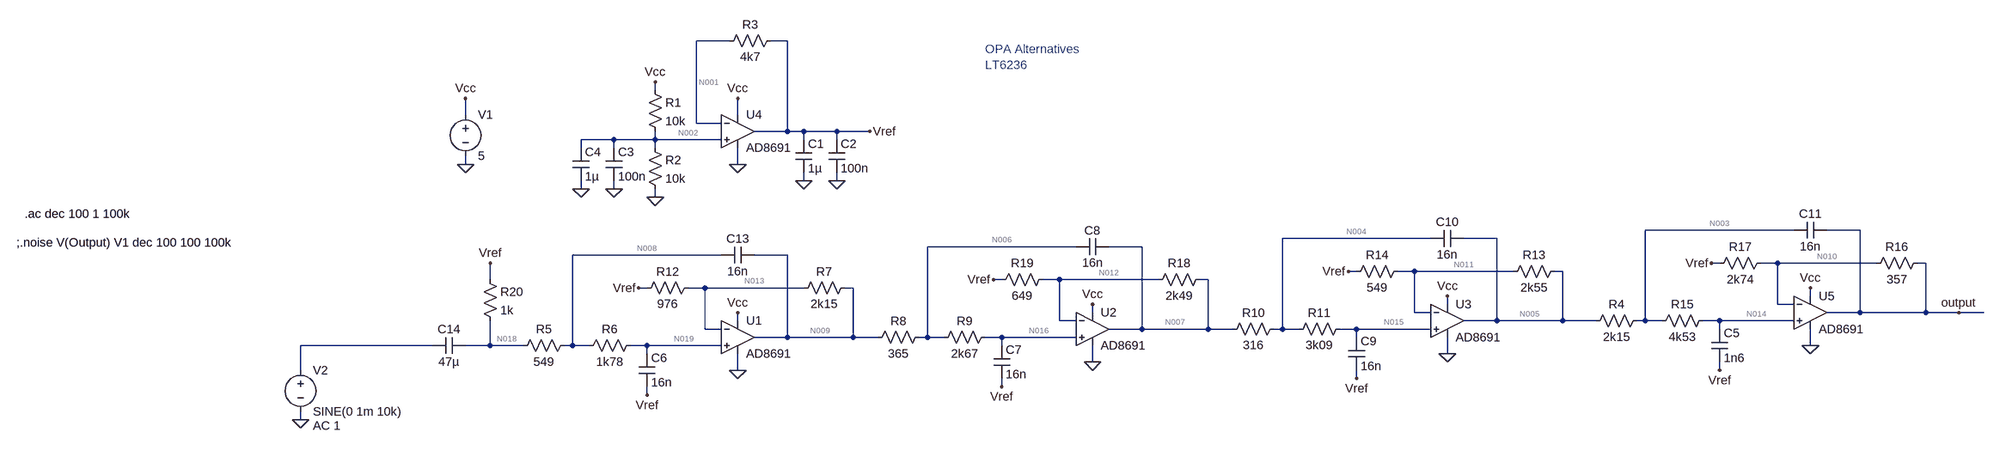
[diagram p0: schematic Input_Stage_10kHz_v2.asc]
Input_Stage_10kHz_v2.asc, the LTspice schematic file:
Version 4
SHEET 1 3012 680
WIRE 272 -400 208 -400
WIRE 384 -400 352 -400
WIRE 128 -304 128 -320
WIRE -240 -256 -240 -288
WIRE 288 -256 288 -288
WIRE 208 -240 208 -400
WIRE 256 -240 208 -240
WIRE 384 -224 384 -400
WIRE 384 -224 320 -224
WIRE 416 -224 384 -224
WIRE 480 -224 416 -224
WIRE 544 -224 480 -224
WIRE 48 -208 -16 -208
WIRE 128 -208 128 -224
WIRE 128 -208 48 -208
WIRE 256 -208 128 -208
WIRE 416 -208 416 -224
WIRE 480 -208 480 -224
WIRE -16 -192 -16 -208
WIRE 48 -192 48 -208
WIRE 128 -192 128 -208
WIRE -240 -160 -240 -176
WIRE 288 -160 288 -192
WIRE 416 -128 416 -144
WIRE 480 -128 480 -144
WIRE -16 -112 -16 -128
WIRE 48 -112 48 -128
WIRE 128 -96 128 -112
WIRE 2336 -32 2048 -32
WIRE 2464 -32 2400 -32
WIRE 1632 -16 1344 -16
WIRE 1760 -16 1696 -16
WIRE 944 0 656 0
WIRE 1072 0 1008 0
WIRE 256 16 -32 16
WIRE 384 16 320 16
WIRE 2192 32 2176 32
WIRE 2304 32 2272 32
WIRE 2496 32 2304 32
WIRE 2592 32 2576 32
WIRE 1488 48 1472 48
WIRE 1600 48 1568 48
WIRE 1792 48 1600 48
WIRE 1888 48 1872 48
WIRE -192 64 -192 32
WIRE 800 64 784 64
WIRE 912 64 880 64
WIRE 1104 64 912 64
WIRE 1200 64 1184 64
WIRE 112 80 96 80
WIRE 224 80 192 80
WIRE 416 80 224 80
WIRE 512 80 496 80
WIRE 2368 96 2368 80
WIRE 1664 112 1664 96
WIRE 2304 112 2304 32
WIRE 2336 112 2304 112
WIRE 976 128 976 112
WIRE 1600 128 1600 48
WIRE 1632 128 1600 128
WIRE 2464 128 2464 -32
WIRE 2464 128 2400 128
WIRE 2592 128 2592 32
WIRE 2592 128 2464 128
WIRE 2656 128 2592 128
WIRE 2704 128 2656 128
WIRE 288 144 288 128
WIRE 912 144 912 64
WIRE 944 144 912 144
WIRE 1760 144 1760 -16
WIRE 1760 144 1696 144
WIRE 1888 144 1888 48
WIRE 1888 144 1760 144
WIRE 1952 144 1888 144
WIRE 2048 144 2048 -32
WIRE 2048 144 2032 144
WIRE 2080 144 2048 144
WIRE 2192 144 2160 144
WIRE 2336 144 2192 144
WIRE 224 160 224 80
WIRE 256 160 224 160
WIRE 1072 160 1072 0
WIRE 1072 160 1008 160
WIRE 1200 160 1200 64
WIRE 1200 160 1072 160
WIRE 1248 160 1200 160
WIRE 1344 160 1344 -16
WIRE 1344 160 1328 160
WIRE 1376 160 1344 160
WIRE 1488 160 1456 160
WIRE 1632 160 1488 160
WIRE 2192 160 2192 144
WIRE 384 176 384 16
WIRE 384 176 320 176
WIRE 512 176 512 80
WIRE 512 176 384 176
WIRE 560 176 512 176
WIRE 656 176 656 0
WIRE 656 176 640 176
WIRE 688 176 656 176
WIRE 800 176 768 176
WIRE 944 176 800 176
WIRE 1488 176 1488 160
WIRE -304 192 -560 192
WIRE -192 192 -192 144
WIRE -192 192 -240 192
WIRE -128 192 -192 192
WIRE -32 192 -32 16
WIRE -32 192 -48 192
WIRE 0 192 -32 192
WIRE 112 192 80 192
WIRE 256 192 112 192
WIRE 800 192 800 176
WIRE 2368 192 2368 160
WIRE 112 208 112 192
WIRE 1664 208 1664 176
WIRE 976 224 976 192
WIRE -560 240 -560 192
WIRE 288 240 288 208
WIRE 2192 240 2192 224
WIRE 1488 256 1488 240
WIRE 800 272 800 256
WIRE 112 288 112 272
WIRE -560 336 -560 320
FLAG -240 -160 0
FLAG -560 336 0
FLAG -240 -288 Vcc
FLAG 288 -160 0
FLAG 288 -288 Vcc
FLAG 128 -320 Vcc
FLAG 128 -96 0
FLAG 416 -128 0
FLAG 480 -128 0
FLAG 544 -224 Vref
FLAG -16 -112 0
FLAG 48 -112 0
FLAG 800 272 Vref
FLAG 976 224 0
FLAG 976 112 Vcc
FLAG 784 64 Vref
FLAG 112 288 Vref
FLAG 288 128 Vcc
FLAG 96 80 Vref
FLAG 2656 128 output
FLAG 1488 256 Vref
FLAG 1664 208 0
FLAG 1664 96 Vcc
FLAG 1472 48 Vref
FLAG 2192 240 Vref
FLAG 2368 192 0
FLAG 2368 80 Vcc
FLAG 2176 32 Vref
FLAG 288 240 0
FLAG -192 32 Vref
SYMBOL voltage -240 -272 R0
WINDOW 123 0 0 Left 0
WINDOW 39 0 0 Left 0
SYMATTR InstName V1
SYMATTR Value 5
SYMBOL voltage -560 224 R0
WINDOW 123 24 124 Left 2
WINDOW 39 0 0 Left 0
SYMATTR Value2 AC 1
SYMATTR InstName V2
SYMATTR Value SINE(0 1m 10k)
SYMBOL res 112 -320 R0
SYMATTR InstName R1
SYMATTR Value 10k
SYMBOL res 112 -208 R0
SYMATTR InstName R2
SYMATTR Value 10k
SYMBOL cap 400 -208 R0
SYMATTR InstName C1
SYMATTR Value 1µ
SYMBOL cap 464 -208 R0
SYMATTR InstName C2
SYMATTR Value 100n
SYMBOL cap 32 -192 R0
SYMATTR InstName C3
SYMATTR Value 100n
SYMBOL cap -32 -192 R0
SYMATTR InstName C4
SYMATTR Value 1µ
SYMBOL res 368 -416 R90
WINDOW 0 0 56 VBottom 2
WINDOW 3 32 56 VTop 2
SYMATTR InstName R3
SYMATTR Value 4k7
SYMBOL res 656 160 R90
WINDOW 0 0 56 VBottom 2
WINDOW 3 32 56 VTop 2
SYMATTR InstName R8
SYMATTR Value 365
SYMBOL res 784 160 R90
WINDOW 0 0 56 VBottom 2
WINDOW 3 32 56 VTop 2
SYMATTR InstName R9
SYMATTR Value 2k67
SYMBOL cap 784 192 R0
SYMATTR InstName C7
SYMATTR Value 16n
SYMBOL cap 1008 -16 R90
WINDOW 0 0 32 VBottom 2
WINDOW 3 32 32 VTop 2
SYMATTR InstName C8
SYMATTR Value 16n
SYMBOL res 1200 48 R90
WINDOW 0 0 56 VBottom 2
WINDOW 3 32 56 VTop 2
SYMATTR InstName R18
SYMATTR Value 2k49
SYMBOL res 896 48 R90
WINDOW 0 0 56 VBottom 2
WINDOW 3 32 56 VTop 2
SYMATTR InstName R19
SYMATTR Value 649
SYMBOL res -32 176 R90
WINDOW 0 0 56 VBottom 2
WINDOW 3 32 56 VTop 2
SYMATTR InstName R5
SYMATTR Value 549
SYMBOL res 96 176 R90
WINDOW 0 0 56 VBottom 2
WINDOW 3 32 56 VTop 2
SYMATTR InstName R6
SYMATTR Value 1k78
SYMBOL cap 96 208 R0
SYMATTR InstName C6
SYMATTR Value 16n
SYMBOL cap 320 0 R90
WINDOW 0 0 32 VBottom 2
WINDOW 3 32 32 VTop 2
SYMATTR InstName C13
SYMATTR Value 16n
SYMBOL res 512 64 R90
WINDOW 0 0 56 VBottom 2
WINDOW 3 32 56 VTop 2
SYMATTR InstName R7
SYMATTR Value 2k15
SYMBOL res 208 64 R90
WINDOW 0 0 56 VBottom 2
WINDOW 3 32 56 VTop 2
SYMATTR InstName R12
SYMATTR Value 976
SYMBOL res 1344 144 R90
WINDOW 0 0 56 VBottom 2
WINDOW 3 32 56 VTop 2
SYMATTR InstName R10
SYMATTR Value 316
SYMBOL res 1472 144 R90
WINDOW 0 0 56 VBottom 2
WINDOW 3 32 56 VTop 2
SYMATTR InstName R11
SYMATTR Value 3k09
SYMBOL cap 1472 176 R0
SYMATTR InstName C9
SYMATTR Value 16n
SYMBOL cap 1696 -32 R90
WINDOW 0 0 32 VBottom 2
WINDOW 3 32 32 VTop 2
SYMATTR InstName C10
SYMATTR Value 16n
SYMBOL res 1888 32 R90
WINDOW 0 0 56 VBottom 2
WINDOW 3 32 56 VTop 2
SYMATTR InstName R13
SYMATTR Value 2k55
SYMBOL res 1584 32 R90
WINDOW 0 0 56 VBottom 2
WINDOW 3 32 56 VTop 2
SYMATTR InstName R14
SYMATTR Value 549
SYMBOL res 2048 128 R90
WINDOW 0 0 56 VBottom 2
WINDOW 3 32 56 VTop 2
SYMATTR InstName R4
SYMATTR Value 2k15
SYMBOL res 2176 128 R90
WINDOW 0 0 56 VBottom 2
WINDOW 3 32 56 VTop 2
SYMATTR InstName R15
SYMATTR Value 4k53
SYMBOL cap 2176 160 R0
SYMATTR InstName C5
SYMATTR Value 1n6
SYMBOL cap 2400 -48 R90
WINDOW 0 0 32 VBottom 2
WINDOW 3 32 32 VTop 2
SYMATTR InstName C11
SYMATTR Value 16n
SYMBOL res 2592 16 R90
WINDOW 0 0 56 VBottom 2
WINDOW 3 32 56 VTop 2
SYMATTR InstName R16
SYMATTR Value 357
SYMBOL res 2288 16 R90
WINDOW 0 0 56 VBottom 2
WINDOW 3 32 56 VTop 2
SYMATTR InstName R17
SYMATTR Value 2k74
SYMBOL OpAmps\\AD8691 288 -288 R0
SYMATTR InstName U4
SYMBOL OpAmps\\AD8691 288 112 R0
SYMATTR InstName U1
SYMBOL OpAmps\\AD8691 976 96 R0
SYMATTR InstName U2
SYMBOL OpAmps\\AD8691 1664 80 R0
SYMATTR InstName U3
SYMBOL OpAmps\\AD8691 2368 64 R0
SYMATTR InstName U5
SYMBOL cap -240 176 R90
WINDOW 0 0 32 VBottom 2
WINDOW 3 32 32 VTop 2
SYMATTR InstName C14
SYMATTR Value 47µ
SYMBOL res -208 48 R0
SYMATTR InstName R20
SYMATTR Value 1k
TEXT -1248 -64 Left 2 !.ac dec 100 1 100k
TEXT 768 -384 Left 2 ;OPA Alternatives\nLT6236
TEXT -1264 -8 Left 2 !;.noise V(Output) V1 dec 100 100 100k

The netlist it stands for:
* Input_Stage_10kHz_v2.asc
V1 Vcc 0 5
V2 N017 0 SINE(0 1m 10k) AC 1
R1 Vcc N002 10k
R2 N002 0 10k
C1 Vref 0 1µ
C2 Vref 0 100n
C3 N002 0 100n
C4 N002 0 1µ
R3 Vref N001 4k7
R8 N006 N009 365
R9 N016 N006 2k67
C7 N016 Vref 16n
C8 N007 N006 16n
R18 N007 N012 2k49
R19 N012 Vref 649
R5 N008 N018 549
R6 N019 N008 1k78
C6 N019 Vref 16n
C13 N009 N008 16n
R7 N009 N013 2k15
R12 N013 Vref 976
R10 N004 N007 316
R11 N015 N004 3k09
C9 N015 Vref 16n
C10 N005 N004 16n
R13 N005 N011 2k55
R14 N011 Vref 549
R4 N003 N005 2k15
R15 N014 N003 4k53
C5 N014 Vref 1n6
C11 output N003 16n
R16 output N010 357
R17 N010 Vref 2k74
XU4 N002 N001 Vcc 0 Vref AD8691  ; pins In+ In- V+ V- OUT
XU1 N019 N013 Vcc 0 N009 AD8691  ; pins In+ In- V+ V- OUT
XU2 N016 N012 Vcc 0 N007 AD8691  ; pins In+ In- V+ V- OUT
XU3 N015 N011 Vcc 0 N005 AD8691  ; pins In+ In- V+ V- OUT
XU5 N014 N010 Vcc 0 output AD8691  ; pins In+ In- V+ V- OUT
C14 N018 N017 47µ
R20 Vref N018 1k
.ac dec 100 1 100k
* OPA Alternatives
* LT6236
;.noise V(Output) V1 dec 100 100 100k
.backanno
.end

* Results of the author's LTspice run, read from the files saved beside the schematic
* Operating Point, zero values left out:
*   V(vcc) = 5 V
*   V(n002) = 2.5 V
*   V(vref) = 2.5 V
*   V(n001) = 2.5 V
*   V(n006) = 2.502 V
*   V(n009) = 2.502 V
*   V(n016) = 2.502 V
*   V(n007) = 2.509 V
*   V(n012) = 2.502 V
*   V(n008) = 2.5 V
*   V(n018) = 2.5 V
*   V(n019) = 2.5 V
*   V(n013) = 2.501 V
*   V(n004) = 2.509 V
*   V(n015) = 2.509 V
*   V(n005) = 2.549 V
*   V(n011) = 2.509 V
*   V(n003) = 2.549 V
*   V(n014) = 2.549 V
*   V(output) = 2.555 V
*   V(n010) = 2.549 V
*   I(R1) = 250 µA
*   I(R2) = 250 µA
*   I(R18) = 2.596 µA
*   I(R19) = 2.596 µA
*   I(R7) = 410.7 nA
*   I(R12) = 410.7 nA
*   I(R13) = 15.57 µA
*   I(R14) = 15.57 µA
*   I(R16) = 17.76 µA
*   I(R17) = 17.76 µA
*   I(V1) = -4.726 mA
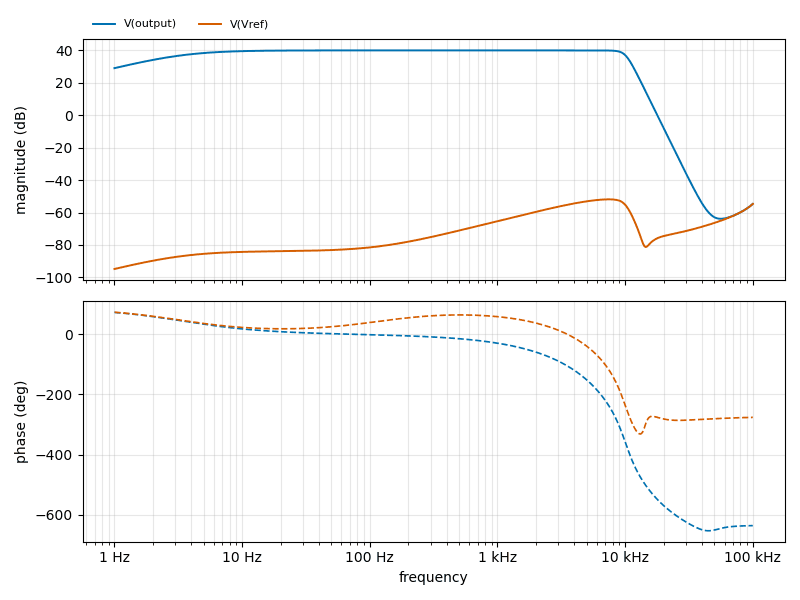
[diagram p1: AC Analysis of Input_Stage_10kHz_v2.asc, plotted from the saved traces]
* AC Analysis, 1 run:
*   V(output): 28.94 dB at 1 Hz, -54.72 dB at 100 kHz, peak 39.90 dB at 436.5 Hz, 3 dB below the peak at 3.387 Hz and 10.03 kHz
*   V(Vref): -94.78 dB at 1 Hz, -54.70 dB at 100 kHz, peak -51.88 dB at 7.413 kHz, 3 dB below the peak at 3.705 kHz and 9.908 kHz